# Altium schematic sheet CAN.SchDoc
size A
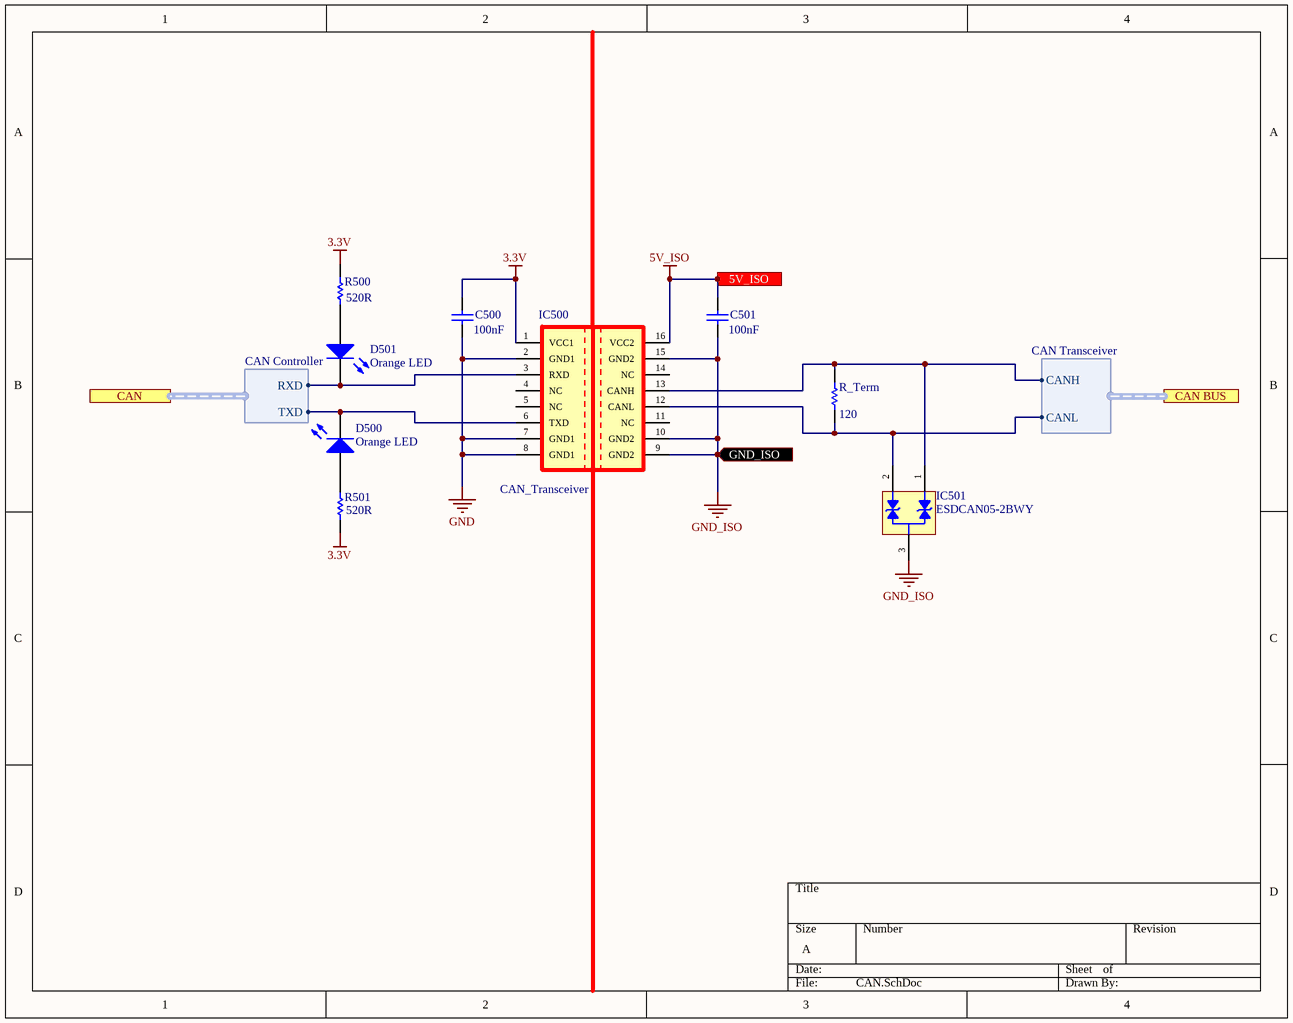
[diagram p0: CAN.SchDoc]

## Parts
C500  value 100nF  [RAD-0.3]  (hidden comment: Cap)
C501  value 100nF  [RAD-0.3]  (hidden comment: Cap)
D500  Orange LED  [LED-0]
D501  Orange LED  [LED-0]
IC500  CAN_Transceiver  [SOIC127P1030X265-16N]
IC501  ESDCAN05-2BWY  [SOT70P210X110-3N]
R500  value 520R  [AXIAL-0.3]  (hidden comment: Res1)
R501  value 520R  [AXIAL-0.3]  (hidden comment: Res1)
R_Term  value 120  [AXIAL-0.3]  (hidden comment: Res1)

## Ports
5V_ISO (in), CAN (harness CAN Controller), CAN BUS (harness CAN Transceiver), GND_ISO (in)

## Harnesses
CAN Controller: TXD, RXD
CAN Transceiver: CANH, CANL

## Nets
3.3V: C500.2 IC500.1(VCC1) R500.2 R501.2
5V_ISO: C501.2 IC500.16(VCC2) ; port 5V_ISO
GND: C500.1 IC500.2(GND1) IC500.7(GND1) IC500.8(GND1)
GND_ISO: C501.1 IC500.9(GND2) IC500.10(GND2) IC500.15(GND2) IC501.3 ; port GND_ISO
NetD500_1: D500.1(A) R501.1
NetD500_2: D500.2(K) IC500.6(TXD) ; port CAN.TXD
NetD501_1: D501.1(A) R500.1
NetD501_2: D501.2(K) IC500.3(RXD) ; port CAN.RXD
NetIC500_12: IC500.12(CANL) IC501.2 R_Term.1 ; port CAN BUS.CANL
NetIC500_13: IC500.13(CANH) IC501.1 R_Term.2 ; port CAN BUS.CANH

Not connected (* = marked no-connect by the designer): IC500 4(NC) 5(NC) 11(NC) 14(NC)

## Library data of the parts
C500 C501 = Cap: Capacitor; Published: 8-Jun-2000; LatestRevisionDate: 17-Jul-2002; LatestRevisionNote: Re-released for DXP Platform.; PackageReference: RAD-0.3; Publisher: Altium Limited; PackageDescription: Radial Cap, Thru-Hole; 2 Leads; 0.3 in Pin Spacing
D500 D501 = LED0: Typical INFRARED GaAs LED; Published: 8-Jun-2000; LatestRevisionDate: 08-Jul-2005; LatestRevisionNote: Mech Layer 1 removed.; PackageReference: LED-0; Publisher: Altium Limited; PackageDescription: LED; 2 Leads
IC500 = ISO1050DWR: Digital Isolators Isolated 5V CAN Xcvr
IC501 = ESDCAN05-2BWY: Automotive dual-line TVS in SOT323-3L for CAN bus
R500 R501 R_Term = Res1: Resistor; Published: 8-Jun-2000; LatestRevisionDate: 17-Jul-2002; LatestRevisionNote: Re-released for DXP Platform.; PackageReference: AXIAL-0.3; Publisher: Altium Limited; PackageDescription: Axial Device, Thru-Hole; 2 Leads; 0.3 in Pin Spacing